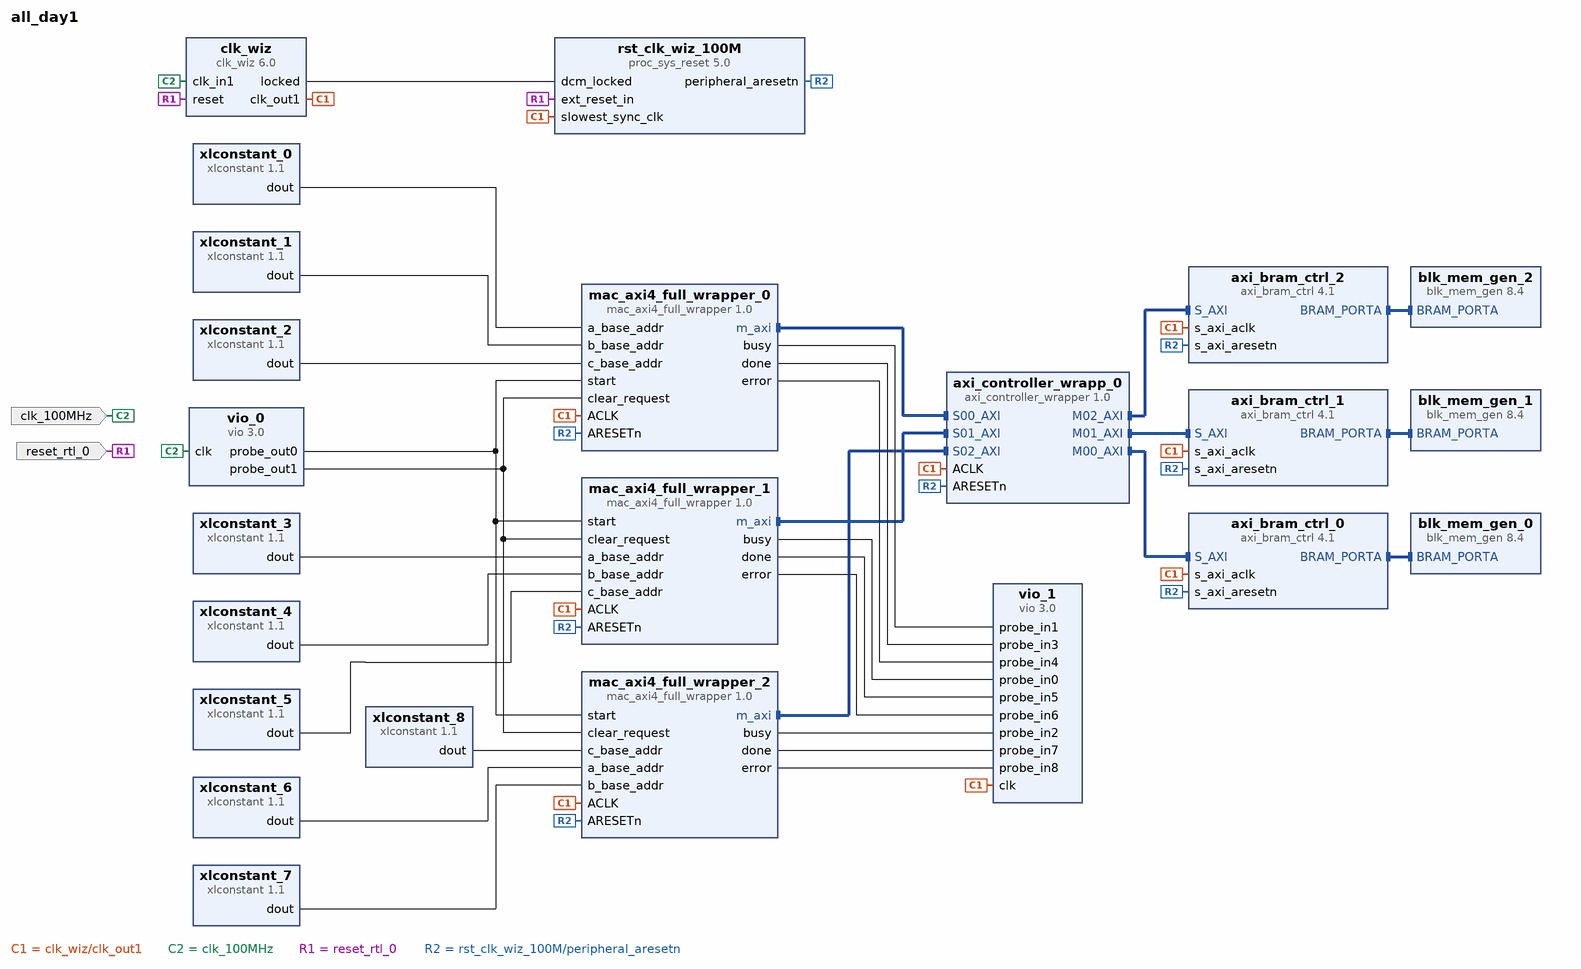
[diagram p0: block diagram of the top level]
# Vivado block design all_day1, xc7z030fbv484-3, Vivado 2025.1
create_bd_design all_day1

create_bd_port -dir I -type clk clk_100MHz
set_property -dict {CONFIG.FREQ_HZ 100000000} [get_bd_ports clk_100MHz]
create_bd_port -dir I -type rst reset_rtl_0
set_property -dict {CONFIG.POLARITY ACTIVE_HIGH} [get_bd_ports reset_rtl_0]

create_bd_cell -type ip -vlnv user.org:user:axi_controller_wrapper:1.0 axi_controller_wrapp_0
create_bd_cell -type ip -vlnv user.org:user:mac_axi4_full_wrapper:1.0 mac_axi4_full_wrapper_0
set_property -dict {CONFIG.AXI_DATA_WIDTH 32} [get_bd_cells mac_axi4_full_wrapper_0]
create_bd_cell -type ip -vlnv user.org:user:mac_axi4_full_wrapper:1.0 mac_axi4_full_wrapper_1
set_property -dict {CONFIG.AXI_DATA_WIDTH 32} [get_bd_cells mac_axi4_full_wrapper_1]
create_bd_cell -type ip -vlnv user.org:user:mac_axi4_full_wrapper:1.0 mac_axi4_full_wrapper_2
set_property -dict {CONFIG.AXI_DATA_WIDTH 32} [get_bd_cells mac_axi4_full_wrapper_2]
create_bd_cell -type ip -vlnv xilinx.com:ip:axi_bram_ctrl:4.1 axi_bram_ctrl_0
set_property -dict {CONFIG.SINGLE_PORT_BRAM 1} [get_bd_cells axi_bram_ctrl_0]
create_bd_cell -type ip -vlnv xilinx.com:ip:blk_mem_gen:8.4 blk_mem_gen_0
create_bd_cell -type ip -vlnv xilinx.com:ip:axi_bram_ctrl:4.1 axi_bram_ctrl_1
set_property -dict {CONFIG.SINGLE_PORT_BRAM 1} [get_bd_cells axi_bram_ctrl_1]
create_bd_cell -type ip -vlnv xilinx.com:ip:axi_bram_ctrl:4.1 axi_bram_ctrl_2
set_property -dict {CONFIG.SINGLE_PORT_BRAM 1} [get_bd_cells axi_bram_ctrl_2]
create_bd_cell -type ip -vlnv xilinx.com:ip:blk_mem_gen:8.4 blk_mem_gen_1
create_bd_cell -type ip -vlnv xilinx.com:ip:blk_mem_gen:8.4 blk_mem_gen_2
create_bd_cell -type ip -vlnv xilinx.com:ip:clk_wiz:6.0 clk_wiz
set_property -dict {CONFIG.CLKOUT1_REQUESTED_OUT_FREQ 100.0} [get_bd_cells clk_wiz]
create_bd_cell -type ip -vlnv xilinx.com:ip:proc_sys_reset:5.0 rst_clk_wiz_100M
create_bd_cell -type ip -vlnv xilinx.com:ip:xlconstant:1.1 xlconstant_0
set_property -dict {CONFIG.CONST_VAL 00000000 CONFIG.CONST_WIDTH 32} [get_bd_cells xlconstant_0]
create_bd_cell -type ip -vlnv xilinx.com:ip:xlconstant:1.1 xlconstant_1
set_property -dict {CONFIG.CONST_VAL 00000100 CONFIG.CONST_WIDTH 32} [get_bd_cells xlconstant_1]
create_bd_cell -type ip -vlnv xilinx.com:ip:xlconstant:1.1 xlconstant_2
set_property -dict {CONFIG.CONST_VAL 00000200 CONFIG.CONST_WIDTH 32} [get_bd_cells xlconstant_2]
create_bd_cell -type ip -vlnv xilinx.com:ip:xlconstant:1.1 xlconstant_3
set_property -dict {CONFIG.CONST_VAL 40000000 CONFIG.CONST_WIDTH 32} [get_bd_cells xlconstant_3]
create_bd_cell -type ip -vlnv xilinx.com:ip:xlconstant:1.1 xlconstant_4
set_property -dict {CONFIG.CONST_VAL 40000100 CONFIG.CONST_WIDTH 32} [get_bd_cells xlconstant_4]
create_bd_cell -type ip -vlnv xilinx.com:ip:xlconstant:1.1 xlconstant_5
set_property -dict {CONFIG.CONST_VAL 40000200 CONFIG.CONST_WIDTH 32} [get_bd_cells xlconstant_5]
create_bd_cell -type ip -vlnv xilinx.com:ip:xlconstant:1.1 xlconstant_6
set_property -dict {CONFIG.CONST_VAL 80000000 CONFIG.CONST_WIDTH 32} [get_bd_cells xlconstant_6]
create_bd_cell -type ip -vlnv xilinx.com:ip:xlconstant:1.1 xlconstant_7
set_property -dict {CONFIG.CONST_VAL 80000100 CONFIG.CONST_WIDTH 32} [get_bd_cells xlconstant_7]
create_bd_cell -type ip -vlnv xilinx.com:ip:xlconstant:1.1 xlconstant_8
set_property -dict {CONFIG.CONST_VAL 80000200 CONFIG.CONST_WIDTH 32} [get_bd_cells xlconstant_8]
create_bd_cell -type ip -vlnv xilinx.com:ip:vio:3.0 vio_0
set_property -dict {CONFIG.C_NUM_PROBE_IN 0 CONFIG.C_NUM_PROBE_OUT 2} [get_bd_cells vio_0]
create_bd_cell -type ip -vlnv xilinx.com:ip:vio:3.0 vio_1
set_property -dict {CONFIG.C_EN_PROBE_IN_ACTIVITY 0 CONFIG.C_NUM_PROBE_IN 9 CONFIG.C_NUM_PROBE_OUT 0} [get_bd_cells vio_1]

# ---- connections ----

connect_bd_intf_net [get_bd_intf_pins blk_mem_gen_0/BRAM_PORTA] [get_bd_intf_pins axi_bram_ctrl_0/BRAM_PORTA]
connect_bd_intf_net [get_bd_intf_pins blk_mem_gen_1/BRAM_PORTA] [get_bd_intf_pins axi_bram_ctrl_1/BRAM_PORTA]
connect_bd_intf_net [get_bd_intf_pins blk_mem_gen_2/BRAM_PORTA] [get_bd_intf_pins axi_bram_ctrl_2/BRAM_PORTA]
connect_bd_intf_net [get_bd_intf_pins axi_bram_ctrl_0/S_AXI] [get_bd_intf_pins axi_controller_wrapp_0/M00_AXI]
connect_bd_intf_net [get_bd_intf_pins axi_bram_ctrl_1/S_AXI] [get_bd_intf_pins axi_controller_wrapp_0/M01_AXI]
connect_bd_intf_net [get_bd_intf_pins axi_bram_ctrl_2/S_AXI] [get_bd_intf_pins axi_controller_wrapp_0/M02_AXI]
connect_bd_intf_net [get_bd_intf_pins mac_axi4_full_wrapper_0/m_axi] [get_bd_intf_pins axi_controller_wrapp_0/S00_AXI]
connect_bd_intf_net [get_bd_intf_pins mac_axi4_full_wrapper_1/m_axi] [get_bd_intf_pins axi_controller_wrapp_0/S01_AXI]
connect_bd_intf_net [get_bd_intf_pins mac_axi4_full_wrapper_2/m_axi] [get_bd_intf_pins axi_controller_wrapp_0/S02_AXI]
connect_bd_net [get_bd_pins clk_wiz/clk_out1] \
  [get_bd_pins axi_bram_ctrl_0/s_axi_aclk] [get_bd_pins mac_axi4_full_wrapper_0/ACLK] \
  [get_bd_pins axi_bram_ctrl_1/s_axi_aclk] [get_bd_pins axi_bram_ctrl_2/s_axi_aclk] \
  [get_bd_pins mac_axi4_full_wrapper_1/ACLK] [get_bd_pins mac_axi4_full_wrapper_2/ACLK] \
  [get_bd_pins rst_clk_wiz_100M/slowest_sync_clk] [get_bd_pins vio_1/clk] [get_bd_pins axi_controller_wrapp_0/ACLK]
connect_bd_net [get_bd_ports clk_100MHz] [get_bd_pins clk_wiz/clk_in1] [get_bd_pins vio_0/clk]
connect_bd_net [get_bd_pins clk_wiz/locked] [get_bd_pins rst_clk_wiz_100M/dcm_locked]
connect_bd_net [get_bd_pins mac_axi4_full_wrapper_0/busy] [get_bd_pins vio_1/probe_in1]
connect_bd_net [get_bd_pins mac_axi4_full_wrapper_0/done] [get_bd_pins vio_1/probe_in3]
connect_bd_net [get_bd_pins mac_axi4_full_wrapper_0/error] [get_bd_pins vio_1/probe_in4]
connect_bd_net [get_bd_pins mac_axi4_full_wrapper_1/busy] [get_bd_pins vio_1/probe_in0]
connect_bd_net [get_bd_pins mac_axi4_full_wrapper_1/done] [get_bd_pins vio_1/probe_in5]
connect_bd_net [get_bd_pins mac_axi4_full_wrapper_1/error] [get_bd_pins vio_1/probe_in6]
connect_bd_net [get_bd_pins mac_axi4_full_wrapper_2/busy] [get_bd_pins vio_1/probe_in2]
connect_bd_net [get_bd_pins mac_axi4_full_wrapper_2/done] [get_bd_pins vio_1/probe_in7]
connect_bd_net [get_bd_pins mac_axi4_full_wrapper_2/error] [get_bd_pins vio_1/probe_in8]
connect_bd_net -net reset_rtl_0_1 [get_bd_ports reset_rtl_0] [get_bd_pins clk_wiz/reset] [get_bd_pins rst_clk_wiz_100M/ext_reset_in]
connect_bd_net [get_bd_pins rst_clk_wiz_100M/peripheral_aresetn] \
  [get_bd_pins mac_axi4_full_wrapper_0/ARESETn] [get_bd_pins mac_axi4_full_wrapper_1/ARESETn] \
  [get_bd_pins mac_axi4_full_wrapper_2/ARESETn] [get_bd_pins axi_bram_ctrl_0/s_axi_aresetn] \
  [get_bd_pins axi_bram_ctrl_1/s_axi_aresetn] [get_bd_pins axi_bram_ctrl_2/s_axi_aresetn] \
  [get_bd_pins axi_controller_wrapp_0/ARESETn]
connect_bd_net [get_bd_pins vio_0/probe_out0] \
  [get_bd_pins mac_axi4_full_wrapper_0/start] [get_bd_pins mac_axi4_full_wrapper_1/start] \
  [get_bd_pins mac_axi4_full_wrapper_2/start]
connect_bd_net [get_bd_pins vio_0/probe_out1] \
  [get_bd_pins mac_axi4_full_wrapper_1/clear_request] [get_bd_pins mac_axi4_full_wrapper_0/clear_request] \
  [get_bd_pins mac_axi4_full_wrapper_2/clear_request]
connect_bd_net [get_bd_pins xlconstant_0/dout] [get_bd_pins mac_axi4_full_wrapper_0/a_base_addr]
connect_bd_net [get_bd_pins xlconstant_1/dout] [get_bd_pins mac_axi4_full_wrapper_0/b_base_addr]
connect_bd_net [get_bd_pins xlconstant_2/dout] [get_bd_pins mac_axi4_full_wrapper_0/c_base_addr]
connect_bd_net [get_bd_pins xlconstant_3/dout] [get_bd_pins mac_axi4_full_wrapper_1/a_base_addr]
connect_bd_net [get_bd_pins xlconstant_4/dout] [get_bd_pins mac_axi4_full_wrapper_1/b_base_addr]
connect_bd_net [get_bd_pins xlconstant_5/dout] [get_bd_pins mac_axi4_full_wrapper_1/c_base_addr]
connect_bd_net [get_bd_pins xlconstant_6/dout] [get_bd_pins mac_axi4_full_wrapper_2/a_base_addr]
connect_bd_net [get_bd_pins xlconstant_7/dout] [get_bd_pins mac_axi4_full_wrapper_2/b_base_addr]
connect_bd_net [get_bd_pins xlconstant_8/dout] [get_bd_pins mac_axi4_full_wrapper_2/c_base_addr]

# ---- address map ----
assign_bd_address -offset 0xC0000000 -range 8K -target_address_space [get_bd_addr_spaces axi_controller_wrapp_0/M00_AXI] [get_bd_addr_segs axi_bram_ctrl_0/S_AXI/Mem0]
assign_bd_address -offset 0xC0000000 -range 8K -target_address_space [get_bd_addr_spaces axi_controller_wrapp_0/M01_AXI] [get_bd_addr_segs axi_bram_ctrl_1/S_AXI/Mem0]
assign_bd_address -offset 0xC0000000 -range 8K -target_address_space [get_bd_addr_spaces axi_controller_wrapp_0/M02_AXI] [get_bd_addr_segs axi_bram_ctrl_2/S_AXI/Mem0]
assign_bd_address -offset 0x00000000 -range 4G -target_address_space [get_bd_addr_spaces mac_axi4_full_wrapper_0/m_axi] [get_bd_addr_segs axi_controller_wrapp_0/S00_AXI/reg0]
assign_bd_address -offset 0x00000000 -range 4G -target_address_space [get_bd_addr_spaces mac_axi4_full_wrapper_1/m_axi] [get_bd_addr_segs axi_controller_wrapp_0/S01_AXI/reg0]
assign_bd_address -offset 0x00000000 -range 4G -target_address_space [get_bd_addr_spaces mac_axi4_full_wrapper_2/m_axi] [get_bd_addr_segs axi_controller_wrapp_0/S02_AXI/reg0]

validate_bd_design
save_bd_design
